# Altium schematic sheet SD_CARD.SchDoc: RFSoC AMC
size 420 x 297 mm; CmpIndex: 52; CompanyName: WUT; DrawnBy: T. Przywozki; Organization: WUT ISE; Address1: Warsaw University of Technology; Address2: Nowowiejska 15/19 00-665 Warsaw; Address3: Tomasz.Przywozki@pw.edu.pl; DocumentNumber: 32; Revision: 1; SheetNumber: 32; SheetTotal: 45; Project: RFSoC AMC; ModifiedBy: T. Przywozki; CreateDate: -; CheckedDate: -; DivGrp: ISE; Designer: T. Przywozki; ModifiedDate: -; ProjectName: ADC/DAC MEZZANINE
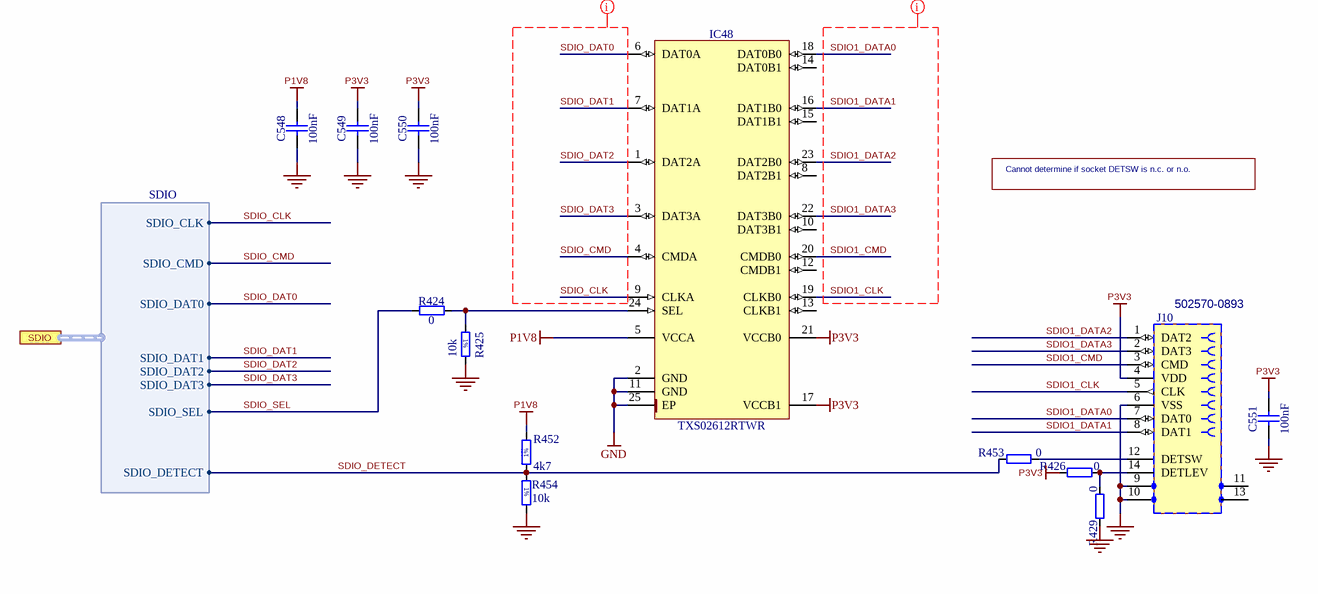
[diagram p0: SD_CARD.SchDoc]

## Parts
C548  100nF  [CAPC0603X33N]
C549  100nF  [CAPC0603X33N]
C550  100nF  [CAPC0603X33N]
C551  100nF  [CAPC0603X33N]
IC48  TXS02612RTWR  [QFN50P400X400X80-25N-S255]
J10  Manufacturer Part Number: 502570-0893  [MOLEX_502570-0893]  (hidden comment: microSD)
R424  0  [RESC1005X40N]
R425  10k  [RESC1005X40N]
R426  0  [RESC1005X40N]
R429  0  [RESC1005X40N]
R452  4k7  [RESC1005X40N]
R453  0  [RESC1005X40N]
R454  10k  [RESC1005X40N]

## Ports
SDIO (harness SDIO)

## Harnesses
SDIO: SDIO_CLK, SDIO_CMD, SDIO_DAT0, SDIO_DAT1, SDIO_DAT2, SDIO_DAT3, SDIO_SEL, SDIO_DETECT

## Nets
GND: C548.2 C549.2 C550.2 C551.2 IC48.2(GND) IC48.11(GND) IC48.25(EP) J10.6(VSS) J10.9 J10.10 R425.2 R429.1 R454.2
P1V8: C548.1 IC48.5(VCCA) R452.2
P3V3: C549.1 C550.1 C551.1 IC48.17(VCCB1) IC48.21(VCCB0) J10.4(VDD) R426.1
SDIO1_CLK: IC48.19(CLKB0) J10.5(CLK)
SDIO1_CMD: IC48.20(CMDB0) J10.3(CMD)
SDIO1_DATA0: IC48.18(DAT0B0) J10.7(DAT0)
SDIO1_DATA1: IC48.16(DAT1B0) J10.8(DAT1)
SDIO1_DATA2: IC48.23(DAT2B0) J10.1(DAT2)
SDIO1_DATA3: IC48.22(DAT3B0) J10.2(DAT3)
SDIO_CLK: IC48.9(CLKA) ; port SDIO.SDIO_CLK
SDIO_CMD: IC48.4(CMDA) ; port SDIO.SDIO_CMD
SDIO_DAT0: IC48.6(DAT0A) ; port SDIO.SDIO_DAT0
SDIO_DAT1: IC48.7(DAT1A) ; port SDIO.SDIO_DAT1
SDIO_DAT2: IC48.1(DAT2A) ; port SDIO.SDIO_DAT2
SDIO_DAT3: IC48.3(DAT3A) ; port SDIO.SDIO_DAT3
SDIO_DETECT: R452.1 R453.1 R454.1 ; port SDIO.SDIO_DETECT
SDIO_SEL: R424.1 ; port SDIO.SDIO_SEL
NetIC48_24: IC48.24(SEL) R424.2 R425.1
NetJ10_12: J10.12(DETSW) R453.2
NetJ10_14: J10.14(DETLEV) R426.2 R429.2

Not connected (* = marked no-connect by the designer): IC48 8(DAT2B1) 10(DAT3B1) 12(CMDB1) 13(CLKB1) 14(DAT0B1) 15(DAT1B1); J10 11 13

## Layout directives
net class SD: SDIO_CLK, SDIO_CMD, SDIO_DAT0, SDIO_DAT1, SDIO_DAT2, SDIO_DAT3
net class SDIO: SDIO1_CLK, SDIO1_CMD, SDIO1_DATA0, SDIO1_DATA1, SDIO1_DATA2, SDIO1_DATA3

## Notes on the sheet
- Cannot determine if socket DETSW is n.c. or n.o.
- Project/Equipment
- Document
- Designer
- Drawn by
- Check.by
- Copyright WUT ISE 2021
  This documentation describes Open Hardware and is licensed under CERN OHL v.1.1. You may redistribute and modify this documentaction under the terms of the CERN OHL v1.1.
  (http://ohwr.org/CERNOHL). This documentation is dristributed WITHOUT ANY EXPRESS OR IMPLIED WARRANTY, INCLUDING OF MERCHANTABLITY, SATISFACTORY QUALITY AND FITNESS FOR A PARTICULAR PURPOSE. Please see the CERN OHL v.1.1 for applicable conditions
- File
- Last Mod.
- Print Date
- Sheet
- Size
- A3
- of
- Rev
- Contact:
- (in symbol R0402_4K7_1%_0.0625W_100PPM) 1%
- (in symbol R0402_10K_1%_0.0625W_100PPM) 1%

## Library data of the parts
C548-C551 = CC0201_100NF_6.3V_10%_X5R: Non-polarised capacitor; Manufacturer: GENERIC; Part Description: SMD Multilayer Chip Ceramic Capacitor; Manufacturer1 Part Number: 02016D104KAT2A; Tolerance: ±10%; Voltage: 6.3V; TC: X5R; Manufacturer Part Number: CC0201_100NF_6.3V_10%_X5R; Part Number: CC0201_100NF_6.3V_10%_X5R; Value: 100nF; Component Kind: Standard; Component Type: Standard; Pin Count: 2; Status: Not Recommended; Case: 0201; Mounted: Yes; Socket: No; SMD: Yes; Sense: No; Manufacturer1 Example: AVX; Manufacturer1 ComponentHeight: 0.33mm; HelpURL: \\cern.ch\dfs\Applications\Altium\Datasheets\CC0201_X5R_AVX.pdf; Author: CERN DEM JLC; CreateDate: 03.12.2007; LatestRevisionDate: 03.12.2007
IC48 = TXS02612RTWR: SDIO Port Expander With Voltage-Level Translation; Manufacturer: TEXAS INSTRUMENTS; PressFit: No; Bonding: No; Part Number: TXS02612RTWR; Component Kind: Standard; Component Type: Standard; Device: TXS02612RTWR; PackageDescription: QFN, 0.50mm Pitch, Square; 24 Pin, 4.00mm L X 4.00mm W X 0.80mm H body (w/Thermal Tab 2.55 X 2.55mm), IPC Medium Density; Part Description: SDIO Port Expander With Voltage-Level Translation; Manufacturer Part Number: TXS02612RTWR; Pin Count: 25; Case: QFN24; Mounted: Yes; Socket: No; SMD: Yes; Sense: No; ComponentHeight: 0.8mm; Author: CERN DEM JLC; HelpURL: \\cern.ch\dfs\Applications\Altium\Datasheets\TXS02612RTWR.pdf; CreateDate: 19.11.2014; LatestRevisionDate: 19.11.2014
J10 = MOLEX_502570-0893: Connector MicroSD 8 Pin; Manufacturer: MOLEX; Part Description: 1.10mm Pitch, Surface Mount, Normal Mount MicroSD Memory Card Connector; PressFit: No; Part Number: MOLEX_502570-0893; Component Kind: Standard; Component Type: Standard; Pin Count: 12; Family: microSD; Mounted: Yes; Socket: No; SMD: Yes; Sense: No; Status: None; ComponentHeight: 2.03mm; HelpURL: \\cern.ch\dfs\Applications\Altium\Datasheets\MOLEX_502570-0893.pdf; Author: CERN DEM JLC; CreateDate: 22.01.2015; LatestRevisionDate: 22.01.2015
R424 = R0402_0R_JUMPER: Resistor; Part Description: 1A (0.05R Max DC Resistance) Zero Ohm Jumper; Manufacturer: GENERIC; Manufacturer1 Part Number: 232270591001L; PressFit: No; Part Number: R0402_0R_JUMPER; Component Kind: Standard; Component Type: Standard; Pin Count: 2; Value: 0; Status: Not Recommended; Manufacturer Part Number: R0402_0R_JUMPER; Case: 0402; Mounted: Yes; Sense: No; Socket: No; SMD: Yes; Manufacturer1 Example: YAGEO PHYCOMP; Manufacturer1 ComponentHeight: 0.4mm; HelpURL: \\cern.ch\dfs\Applications\Altium\Datasheets\R0402_Phycomp_RC0402.pdf; Author: CERN DEM JLC; CreateDate: 03.12.2007; LatestRevisionDate: 17.10.2012
R425 = R0402_10K_1%_0.0625W_100PPM: Resistor - 1%; Manufacturer: GENERIC; Part Description: General Purpose Thick Film Chip Resistor; Manufacturer1 Part Number: 232270671003L; TC: ±100ppm/°C; PressFit: No; Manufacturer Part Number: R0402_10K_1%_0.0625W_100PPM; Part Number: R0402_10K_1%_0.0625W_100PPM; Tolerance: ±1%; Value: 10k; Component Kind: Standard; Component Type: Standard; Pin Count: 2; Status: Not Recommended; Power: 0.0625W; Case: 0402; Mounted: Yes; Sense: No; Socket: No; SMD: Yes; Manufacturer1 Example: YAGEO PHYCOMP; Manufacturer1 ComponentHeight: 0.4mm; HelpURL: \\cern.ch\dfs\Applications\Altium\Datasheets\R0402_Phycomp_RC0402.pdf; Author: CERN DEM JLC; CreateDate: 03/12/2007; LatestRevisionDate: 17/10/2012
R426 R429 R453 = R0402_0R_JUMPER: Resistor; Manufacturer: GENERIC; Part Description: 1A (0.05R Max DC Resistance) Zero Ohm Jumper; Manufacturer1 Part Number: 232270591001L; PressFit: No; Manufacturer Part Number: R0402_0R_JUMPER; Part Number: R0402_0R_JUMPER; Value: 0; Component Kind: Standard; Component Type: Standard; Pin Count: 2; Status: Not Recommended; Case: 0402; Mounted: Yes; Sense: No; Socket: No; SMD: Yes; Manufacturer1 Example: YAGEO PHYCOMP; Manufacturer1 ComponentHeight: 0.4mm; HelpURL: \\cern.ch\dfs\Applications\Altium\Datasheets\R0402_Phycomp_RC0402.pdf; Author: CERN DEM JLC
  R426 R429: CreateDate: 03/12/2007; LatestRevisionDate: 17/10/2012
  R453: CreateDate: 03.12.2007; LatestRevisionDate: 17.10.2012
R452 = R0402_4K7_1%_0.0625W_100PPM: Resistor - 1%; Manufacturer: GENERIC; Part Description: General Purpose Thick Film Chip Resistor; Manufacturer1 Part Number: 232270674702L; TC: ±100ppm/°C; PressFit: No; Manufacturer Part Number: R0402_4K7_1%_0.0625W_100PPM; Part Number: R0402_4K7_1%_0.0625W_100PPM; Tolerance: ±1%; Value: 4k7; Component Kind: Standard; Component Type: Standard; Pin Count: 2; Status: Not Recommended; Power: 0.0625W; Case: 0402; Mounted: Yes; Sense: No; Socket: No; SMD: Yes; Manufacturer1 Example: YAGEO PHYCOMP; Manufacturer1 ComponentHeight: 0.4mm; HelpURL: \\cern.ch\dfs\Applications\Altium\Datasheets\R0402_Phycomp_RC0402.pdf; Author: CERN DEM JLC; CreateDate: 03/12/2007; LatestRevisionDate: 17/10/2012
R454 = R0402_10K_1%_0.0625W_100PPM: Resistor - 1%; Part Description: General Purpose Thick Film Chip Resistor; Manufacturer: GENERIC; Manufacturer1 Part Number: 232270671003L; TC: ±100ppm/°C; Table: Resistors SMD; Part Number: R0402_10K_1%_0.0625W_100PPM; Component Kind: Standard; Component Type: Standard; Pin Count: 2; Value: 10k; Status: Not recommended; Power: 0.0625W; Tolerance: ±1%; Manufacturer Part Number: R0402_10K_1%_0.0625W_100PPM; Case: 0402; Mounted: Yes; Socket: No; SMD: Yes; Manufacturer1 Example: YAGEO PHYCOMP; Manufacturer1 ComponentHeight: 0.4mm; HelpURL: \\cern.ch\dfs\Applications\Altium\Datasheets\R0402_Phycomp_RC0402.pdf; Author: CERN DEM JLC; CreateDate: 2007-12-03; LatestRevisionDate: 2012-10-17